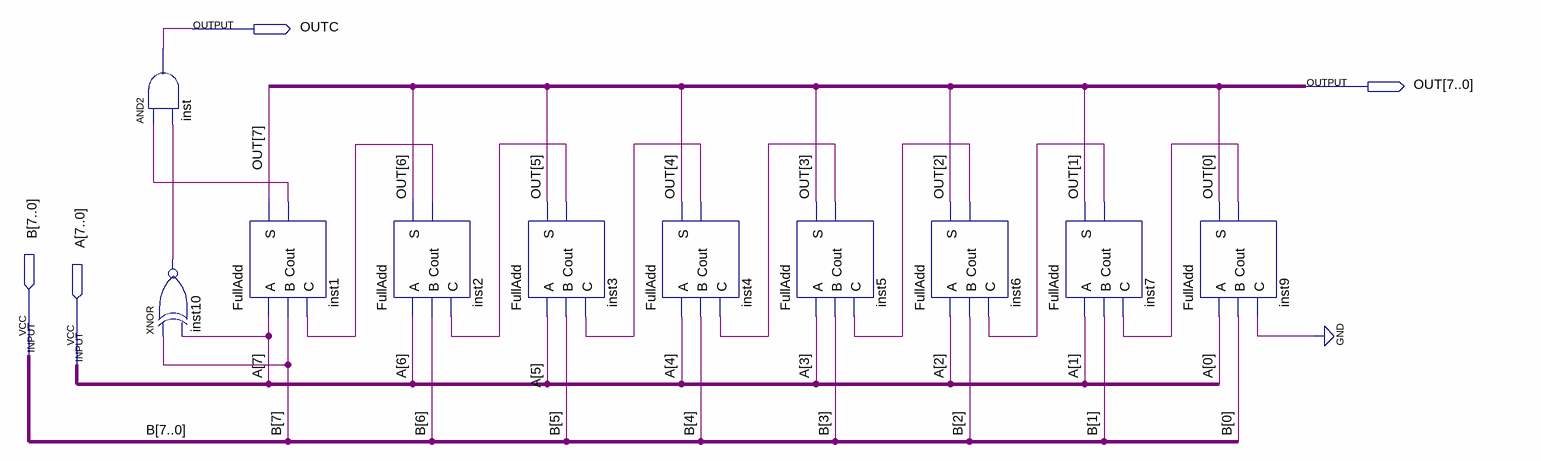
[diagram p0: schematic sheet]
// Quartus schematic FullAdd8.bdf as structural Verilog: 10 symbols, 4 pins
module FullAdd8 (
  input  [7:0] B,
  input  [7:0] A,
  output OUTC,
  output [7:0] OUT
);

  wire inst1_cout, inst2_cout, inst3_cout, inst4_cout, inst5_cout, inst6_cout, inst7_cout, inst9_cout,
       inst10_out;

  and inst (OUTC, inst1_cout, inst10_out);
  xnor inst10 (inst10_out, B[7], A[7]);
  FullAdd inst1 (.A(A[7]), .B(B[7]), .C(inst2_cout), .S(OUT[7]), .Cout(inst1_cout));
  FullAdd inst2 (.A(A[6]), .B(B[6]), .C(inst3_cout), .S(OUT[6]), .Cout(inst2_cout));
  FullAdd inst3 (.A(A[5]), .B(B[5]), .C(inst4_cout), .S(OUT[5]), .Cout(inst3_cout));
  FullAdd inst4 (.A(A[4]), .B(B[4]), .C(inst5_cout), .S(OUT[4]), .Cout(inst4_cout));
  FullAdd inst5 (.A(A[3]), .B(B[3]), .C(inst6_cout), .S(OUT[3]), .Cout(inst5_cout));
  FullAdd inst6 (.A(A[2]), .B(B[2]), .C(inst7_cout), .S(OUT[2]), .Cout(inst6_cout));
  FullAdd inst7 (.A(A[1]), .B(B[1]), .C(inst9_cout), .S(OUT[1]), .Cout(inst7_cout));
  FullAdd inst9 (.A(A[0]), .B(B[0]), .C(1'b0), .S(OUT[0]), .Cout(inst9_cout));
endmodule
